# EAGLE schematic MIPS_Rev5.4 (EAGLE 9.6.2)

## Sheet 1 of 2
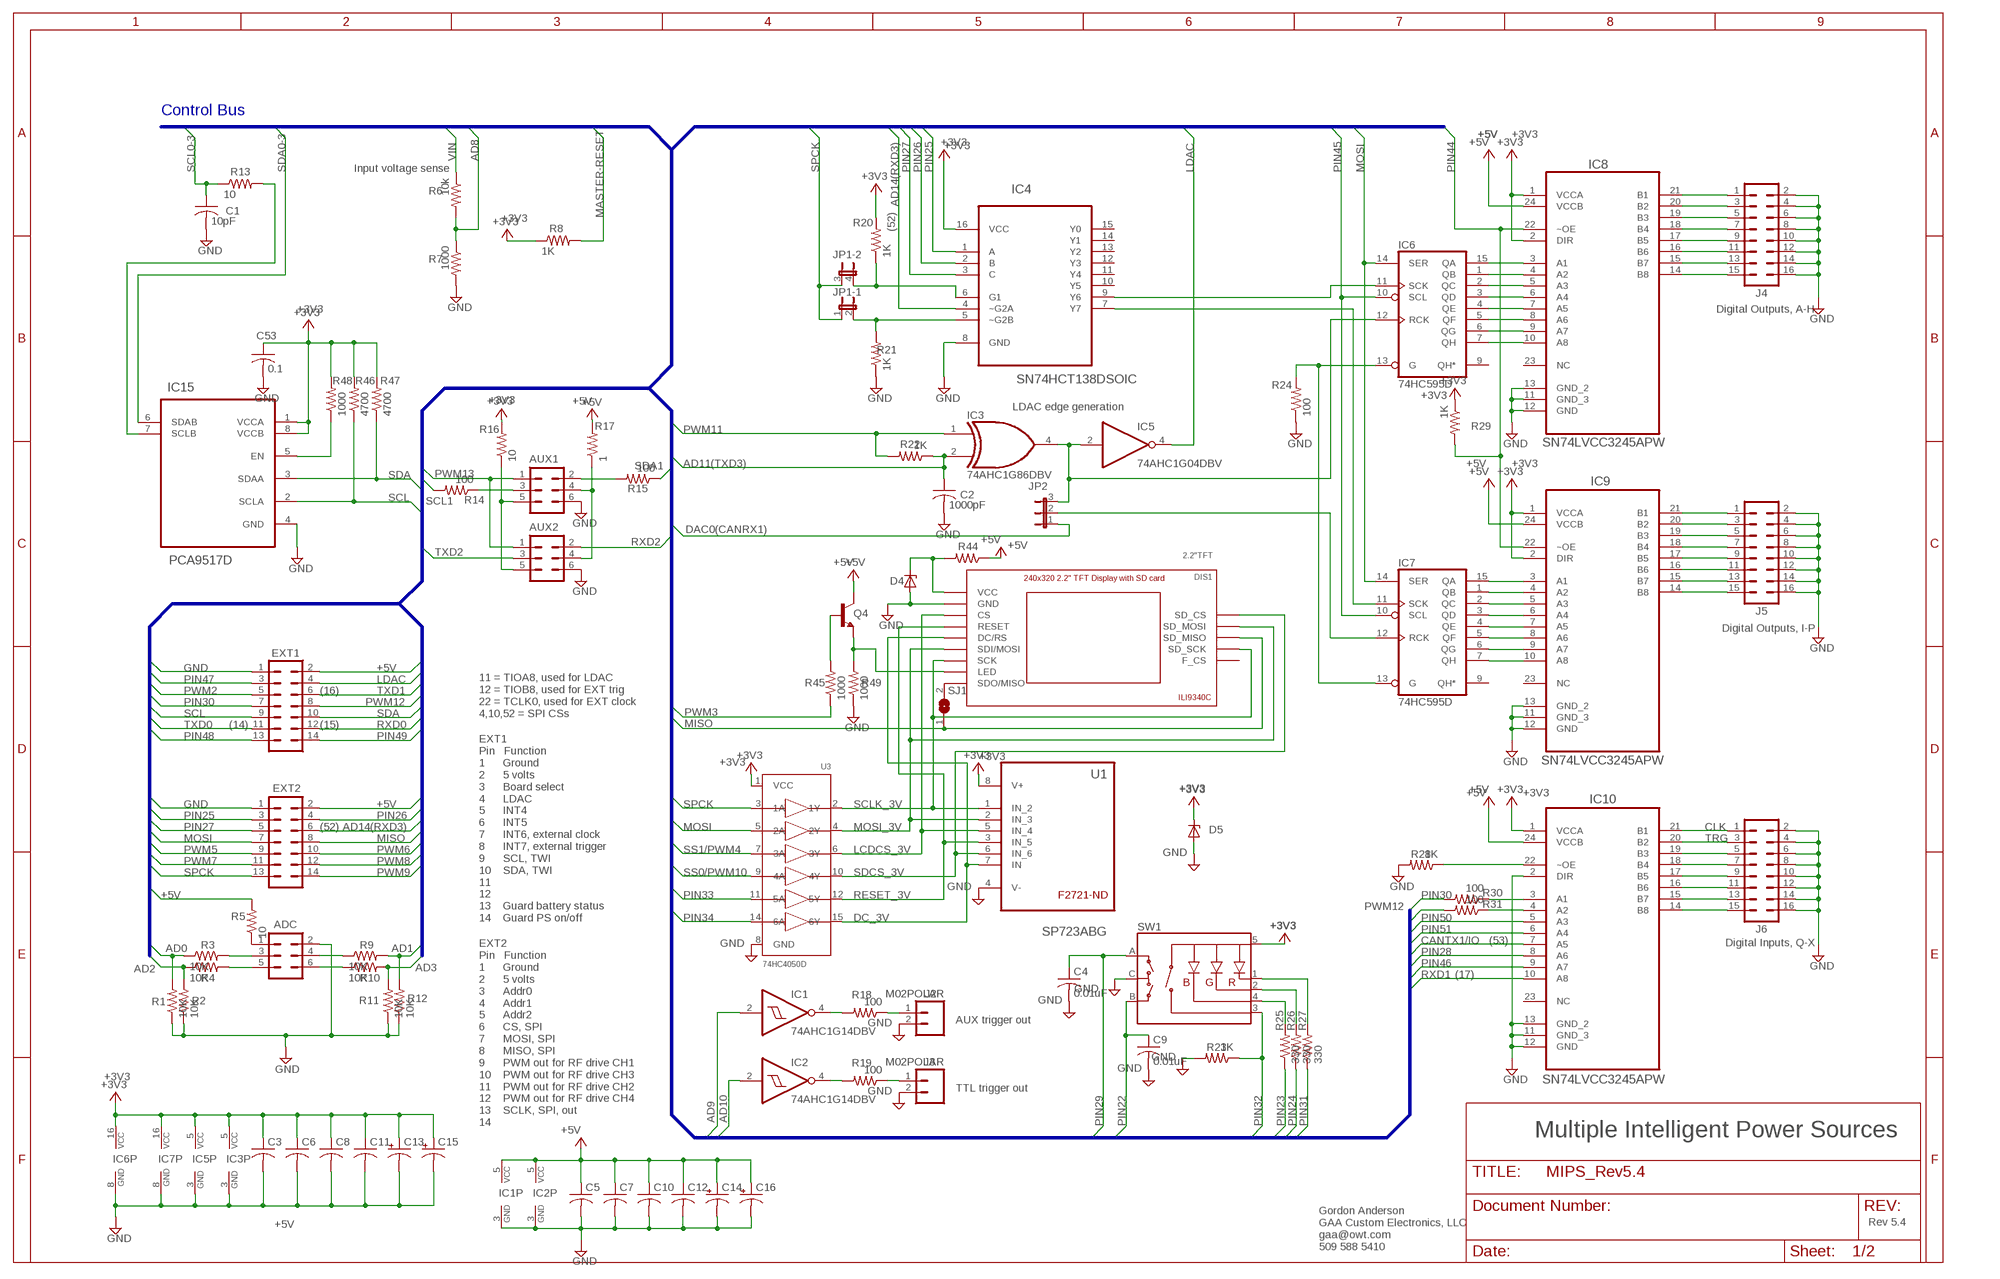
[diagram p0: schematic, sheet 1]

### Parts
ADC  ML6  [ML6]
AUX1  ML6  [ML6]
AUX2  ML6  [ML6]
C1  10pF  C-USC0805  [C0805]
C2  1000pF  C-USC0805  [C0805]
C3  C-USC0805  [C0805]
C4  0.01uF  C-USC0805  [C0805]
C5  C-USC0805  [C0805]
C6  C-USC0805  [C0805]
C7  C-USC0805  [C0805]
C8  C-USC0805  [C0805]
C9  0.01uF  C-USC0805  [C0805]
C10  C-USC0805  [C0805]
C11  C-USC0805  [C0805]
C12  C-USC0805  [C0805]
C13  CPOL-USA/3216-18R  [A/3216-18R]
C14  CPOL-USA/3216-18R  [A/3216-18R]
C15  CPOL-USA/3216-18R  [A/3216-18R]
C16  CPOL-USA/3216-18R  [A/3216-18R]
C53  0.1  C-USC0805  [C0805]
D4  ZENER-DIODESOD123  [SOD123]
D5  ZENER-DIODESOD123  [SOD123]
DIS1  2.2"TFT  [2.2"TFT]
EXT1  ML14  [ML14]
EXT2  ML14  [ML14]
IC1  74AHC1G14DBV  [SOT23-5]
IC2  74AHC1G14DBV  [SOT23-5]
IC3  74AHC1G86DBV  [SOT23-5]
IC4  SN74HCT138DSOIC  [SO16]
IC5  74AHC1G04DBV  [SOT23-5]
IC6  74HC595D  [SO16]
IC7  74HC595D  [SO16]
IC8  SN74LVCC3245APW  [SOP65P640X120-24N]
IC9  SN74LVCC3245APW  [SOP65P640X120-24N]
IC10  SN74LVCC3245APW  [SOP65P640X120-24N]
IC15  PCA9517D  [SOIC127P600X175-8N]
J2  M02POLAR  [MOLEX-1X2]
J3  M02POLAR  [MOLEX-1X2]
J4  ML16  [ML16]
J5  ML16  [ML16]
J6  ML16  [ML16]
JP1  JP2QE  [JP2Q]
JP2  JP2E  [JP2]
Q4  MMBT2222ALT1-NPN-SOT23-BEC  [SOT23-BEC]
R1  10K  R-US_R0805  [R0805]
R2  10K  R-US_R0805  [R0805]
R3  10K  R-US_R0805  [R0805]
R4  10K  R-US_R0805  [R0805]
R5  10  R-US_R1206  [R1206]
R6  10k  R-US_R0805  [R0805]
R7  1000  R-US_R0805  [R0805]
R8  1K  R-US_R0805  [R0805]
R9  10K  R-US_R0805  [R0805]
R10  10K  R-US_R0805  [R0805]
R11  10K  R-US_R0805  [R0805]
R12  10K  R-US_R0805  [R0805]
R13  10  R-US_R0805  [R0805]
R14  100  R-US_R0805  [R0805]
R15  100  R-US_R0805  [R0805]
R16  10  R-US_R0805  [R0805]
R17  1  R-US_R0805  [R0805]
R18  100  R-US_R0805  [R0805]
R19  100  R-US_R0805  [R0805]
R20  1K  R-US_R0805  [R0805]
R21  1K  R-US_R0805  [R0805]
R22  1K  R-US_R0805  [R0805]
R23  1K  R-US_R0805  [R0805]
R24  100  R-US_R0805  [R0805]
R25  330  R-US_R0805  [R0805]
R26  330  R-US_R0805  [R0805]
R27  330  R-US_R0805  [R0805]
R28  1K  R-US_R0805  [R0805]
R29  1K  R-US_R0805  [R0805]
R30  100  R-US_R0805  [R0805]
R31  100  R-US_R0805  [R0805]
R44  R-US_R0805  [R0805]
R45  1000  R-US_R0805  [R0805]
R46  4700  R-US_R0805  [R0805]
R47  4700  R-US_R0805  [R0805]
R48  1000  R-US_R0805  [R0805]
R49  1000  R-US_R0805  [R0805]
SJ1  SJ  [SJ]
SW1  ENCODER_RGB_CA  [ENCODER_LED_3]
U1  SP723ABG  [SOIC127P600X175-8N]
U3  74HC4050D  [SOIC16]

### Nets
+3V3: C3.1 C6.1 C8.1 C11.1 C13.+ C15.+ C53.1 D5.C IC3.5(VCC) IC4.16(VCC) IC5.5(VCC) IC6.16(VCC) IC7.16(VCC) IC8.1(VCCA) IC8.2(DIR) IC9.1(VCCA) IC9.2(DIR) IC10.1(VCCA) IC15.1(VCCA) IC15.8(VCCB) R8.1 R16.2 R20.2 R29.1 R46.2 R47.2 R48.2 SW1.5(+) U1.8(V+) U3.1(VCC) ; also sheet 2
+5V [USB]: C5.1 C7.1 C10.1 C12.1 C14.+ C16.+ EXT1.2 EXT2.2 IC1.5(VCC) IC2.5(VCC) IC8.24(VCCB) IC9.24(VCCB) IC10.24(VCCB) Q4.C R5.2 R17.2 R44.1 ; also sheet 2
AD0: R1.2 R3.1 ; also sheet 2
AD1: R9.2 R12.2 ; also sheet 2
AD2: R2.2 R4.1 ; also sheet 2
AD3: R10.2 R11.2 ; also sheet 2
AD8: R6.2 R7.1 ; also sheet 2
AD9: IC1.2(I) ; also sheet 2
AD10: IC2.2(I) ; also sheet 2
AD11(TXD3): C2.1 IC3.2(I1) R22.1 ; also sheet 2
AD14(RXD3): EXT2.6 IC4.4(~G2A) ; also sheet 2
CANTX1/IO: IC10.7(A5) ; also sheet 2
DAC0(CANRX1): JP2.1 ; also sheet 2
DC_3V: DIS1.DC/RS U1.7(IN) U3.15(6Y)
GND [USB]: ADC.2 AUX1.6 AUX2.6 C1.2 C2.2 C3.2 C4.2 C5.2 C6.2 C7.2 C8.2 C9.2 C10.2 C11.2 C12.2 C13.- C14.- C15.- C16.- C53.2 D4.A D5.A DIS1.GND EXT1.1 EXT2.1 IC1.3(GND) IC2.3(GND) IC3.3(GND) IC4.8(GND) IC5.3(GND) IC6.8(GND) IC7.8(GND) IC8.11(GND_3) IC8.12(GND) IC8.13(GND_2) IC9.11(GND_3) IC9.12(GND) IC9.13(GND_2) IC10.2(DIR) IC10.11(GND_3) IC10.12(GND) IC10.13(GND_2) IC15.4(GND) J2.2 J3.2 J4.2 J4.4 J4.6 J4.8 J4.10 J4.12 J4.14 J4.16 J5.2 J5.4 J5.6 J5.8 J5.10 J5.12 J5.14 J5.16 J6.2 J6.4 J6.6 J6.8 J6.10 J6.12 J6.14 J6.16 R1.1 R2.1 R7.2 R11.1 R12.1 R21.1 R23.2 R24.1 R28.2 R49.1 SW1.C U1.4(V-) U3.8(GND) ; also sheet 2
LCDCS_3V: DIS1.CS U1.5(IN_4) U3.6(3Y)
LDAC: EXT1.4 IC5.4(O)
MASTER-RESET: R8.2 ; also sheet 2
MISO: DIS1.SD_MISO EXT2.8 SJ1.1 ; also sheet 2
MOSI: EXT2.7 IC6.14(SER) IC7.14(SER) U3.5(2A) ; also sheet 2
MOSI_3V: DIS1.SD_MOSI DIS1.SDI/MOSI U1.2(IN_3) U3.4(2Y)
N$1: IC6.15(QA) IC8.3(A1)
N$2: IC6.1(QB) IC8.4(A2)
N$3: IC6.2(QC) IC8.5(A3)
N$4: IC6.3(QD) IC8.6(A4)
N$5: IC6.4(QE) IC8.7(A5)
N$6: IC6.5(QF) IC8.8(A6)
N$7: IC6.6(QG) IC8.9(A7)
N$8: IC6.7(QH) IC8.10(A8)
N$9: IC7.1(QB) IC9.4(A2)
N$10: IC7.2(QC) IC9.5(A3)
N$11: IC7.3(QD) IC9.6(A4)
N$12: IC7.4(QE) IC9.7(A5)
N$13: IC7.5(QF) IC9.8(A6)
N$14: IC7.6(QG) IC9.9(A7)
N$15: IC7.7(QH) IC9.10(A8)
N$16: IC7.15(QA) IC9.3(A1)
N$17: IC9.21(B1) J5.1
N$18: IC9.20(B2) J5.3
N$19: IC9.19(B3) J5.5
N$20: IC9.18(B4) J5.7
N$21: IC9.17(B5) J5.9
N$22: IC9.16(B6) J5.11
N$23: IC9.15(B7) J5.13
N$24: IC9.14(B8) J5.15
N$25: IC8.21(B1) J4.1
N$26: IC8.20(B2) J4.3
N$27: IC8.19(B3) J4.5
N$28: IC8.18(B4) J4.7
N$29: IC8.17(B5) J4.9
N$30: IC8.16(B6) J4.11
N$31: IC8.15(B7) J4.13
N$32: IC8.14(B8) J4.15
N$33: IC10.21(B1) J6.1
N$34: IC10.20(B2) J6.3
N$35: IC10.19(B3) J6.5
N$36: IC10.18(B4) J6.7
N$37: IC10.17(B5) J6.9
N$38: IC10.16(B6) J6.11
N$39: IC10.15(B7) J6.13
N$40: IC10.14(B8) J6.15
N$41: IC4.7(Y7) IC7.11(SCK)
N$42: ADC.3 R3.2
N$43: ADC.1 R5.1
N$44: ADC.4 R9.1
N$45: ADC.5 R4.2
N$46: IC10.22(~OE) R28.1
N$47: ADC.6 R10.1
N$48: IC7.12(RCK) JP2.2
N$49: IC15.5(EN) R48.1
N$50: IC10.3(A1) R30.1
N$51: IC10.4(A2) R31.1
N$52: D4.C DIS1.P$9VCC(VCC) R44.2
N$53: IC15.7(SCLB) R13.2
N$54: DIS1.SDO/MISO SJ1.2
N$55: IC2.4(O) R19.2
N$56: IC1.4(O) R18.2
N$57: J3.1 R19.1
N$58: IC6.13(G) IC7.13(G) R24.2
N$59: J2.1 R18.1
N$60: AUX1.2 R15.2
N$61: AUX1.3 R14.1
N$62: AUX1.4 AUX2.4 R17.1
N$64: AUX1.5 AUX2.5 R16.1
N$78: DIS1.LED Q4.E R49.2
N$80: Q4.B R45.2
N$93: IC4.9(Y6) IC6.11(SCK)
N$97: IC4.5(~G2B) JP1.2 R21.2
N$98: IC4.6(G1) JP1.4 R20.1
N$101: R27.2 SW1.1(-R)
N$102: R26.2 SW1.2(-G)
N$103: R25.2 SW1.4(-B)
PIN22: C9.1 SW1.B ; also sheet 2
PIN23: R25.1 ; also sheet 2
PIN24: R26.1 ; also sheet 2
PIN25: EXT2.3 IC4.1(A) ; also sheet 2
PIN26: EXT2.4 IC4.2(B) ; also sheet 2
PIN27: EXT2.5 IC4.3(C) ; also sheet 2
PIN28: IC10.8(A6) ; also sheet 2
PIN29: C4.1 SW1.A ; also sheet 2
PIN30: EXT1.7 R30.2 ; also sheet 2
PIN31: R27.1 ; also sheet 2
PIN32: R23.1 SW1.3(SW) ; also sheet 2
PIN33: U3.11(5A) ; also sheet 2
PIN34: U3.14(6A) ; also sheet 2
PIN44: IC8.22(~OE) IC9.22(~OE) R29.2 ; also sheet 2
PIN45: IC6.10(SCL) IC7.10(SCL) ; also sheet 2
PIN46: IC10.9(A7) ; also sheet 2
PIN47: EXT1.3 ; also sheet 2
PIN48: EXT1.13 ; also sheet 2
PIN49: EXT1.14 ; also sheet 2
PIN50: IC10.5(A3) ; also sheet 2
PIN51: IC10.6(A4) ; also sheet 2
PWM2: EXT1.5 ; also sheet 2
PWM3: R45.1 ; also sheet 2
PWM5: EXT2.9 ; also sheet 2
PWM6: EXT2.10 ; also sheet 2
PWM7: EXT2.11 ; also sheet 2
PWM8: EXT2.12 ; also sheet 2
PWM9: EXT2.14 ; also sheet 2
PWM11: IC3.1(I0) R22.2 ; also sheet 2
PWM12: EXT1.8 R31.2 ; also sheet 2
PWM13: AUX1.1 AUX2.1 ; also sheet 2
RESET_3V: DIS1.RESET U1.3(IN_5) U3.12(5Y)
RXD0: EXT1.12 ; also sheet 2
RXD1: IC10.10(A8) ; also sheet 2
RXD2: AUX2.2 ; also sheet 2
SCL: EXT1.9 IC15.2(SCLA) R46.1
SCL0-3: C1.1 R13.1 ; also sheet 2
SCL1: R14.2 ; also sheet 2
SCLK_3V: DIS1.SCK DIS1.SD_SCK U1.1(IN_2) U3.2(1Y)
SDA: EXT1.10 IC15.3(SDAA) R47.1
SDA0-3: IC15.6(SDAB) ; also sheet 2
SDA1: R15.1 ; also sheet 2
SDCS_3V: DIS1.SD_CS U1.6(IN_6) U3.10(4Y)
SPCK: EXT2.13 JP1.1 JP1.3 U3.3(1A) ; also sheet 2
SS0/PWM10: U3.9(4A) ; also sheet 2
SS1/PWM4: U3.7(3A) ; also sheet 2
TXD0: EXT1.11 ; also sheet 2
TXD1: EXT1.6 ; also sheet 2
TXD2: AUX2.3 ; also sheet 2
VIN: R6.1 ; also sheet 2
~LDAC: IC3.4(O) IC5.2(I) IC6.12(RCK) JP2.3
Unconnected: DIS1.F_CS IC4.10(Y5) IC4.11(Y4) IC4.12(Y3) IC4.13(Y2) IC4.14(Y1) IC4.15(Y0) IC6.9(QH*) IC7.9(QH*) IC8.23(NC) IC9.23(NC) IC10.23(NC)

### Buses
+5V,DAC0(CANRX1),MISO,N$73,N$74,N$75,N$79,N$81,PWM3,SCL1,SDA1

### Notes on the sheet
- Control Bus
- Input voltage sense
- (52)
- Digital Outputs, A-H
- LDAC edge generation
- Digital Outputs, I-P
- (16)
- 11 = TIOA8, used for LDAC
  12 = TIOB8, used for EXT trig
  22 = TCLK0, used for EXT clock
  4,10,52 = SPI CSs
- (14) | (15)
- (52) | CLK
- TRG
- F2721-ND
- EXT1
  Pin   Function
  1      Ground
  2      5 volts
  3      Board select
  4      LDAC
  5      INT4
  6      INT5
  7      INT6, external clock
  8      INT7, external trigger
  9      SCL, TWI
  10    SDA, TWI
  11
  12
  13    Guard battery status
  14    Guard PS on/off
- (53) | Digital Inputs, Q-X
- (17)
- AUX trigger out
- TTL trigger out
- EXT2
  Pin   Function
  1      Ground
  2      5 volts
  3      Addr0
  4      Addr1
  5      Addr2
  6      CS, SPI
  7      MOSI, SPI
  8      MISO, SPI
  9      PWM out for RF drive CH1
  10    PWM out for RF drive CH3
  11    PWM out for RF drive CH2
  12    PWM out for RF drive CH4
  13    SCLK, SPI, out
  14
- Multiple Intelligent Power Sources
- Rev 5.4
- Gordon Anderson
  GAA Custom Electronics, LLC
  gaa@owt.com
  509 588 5410

## Sheet 2 of 2
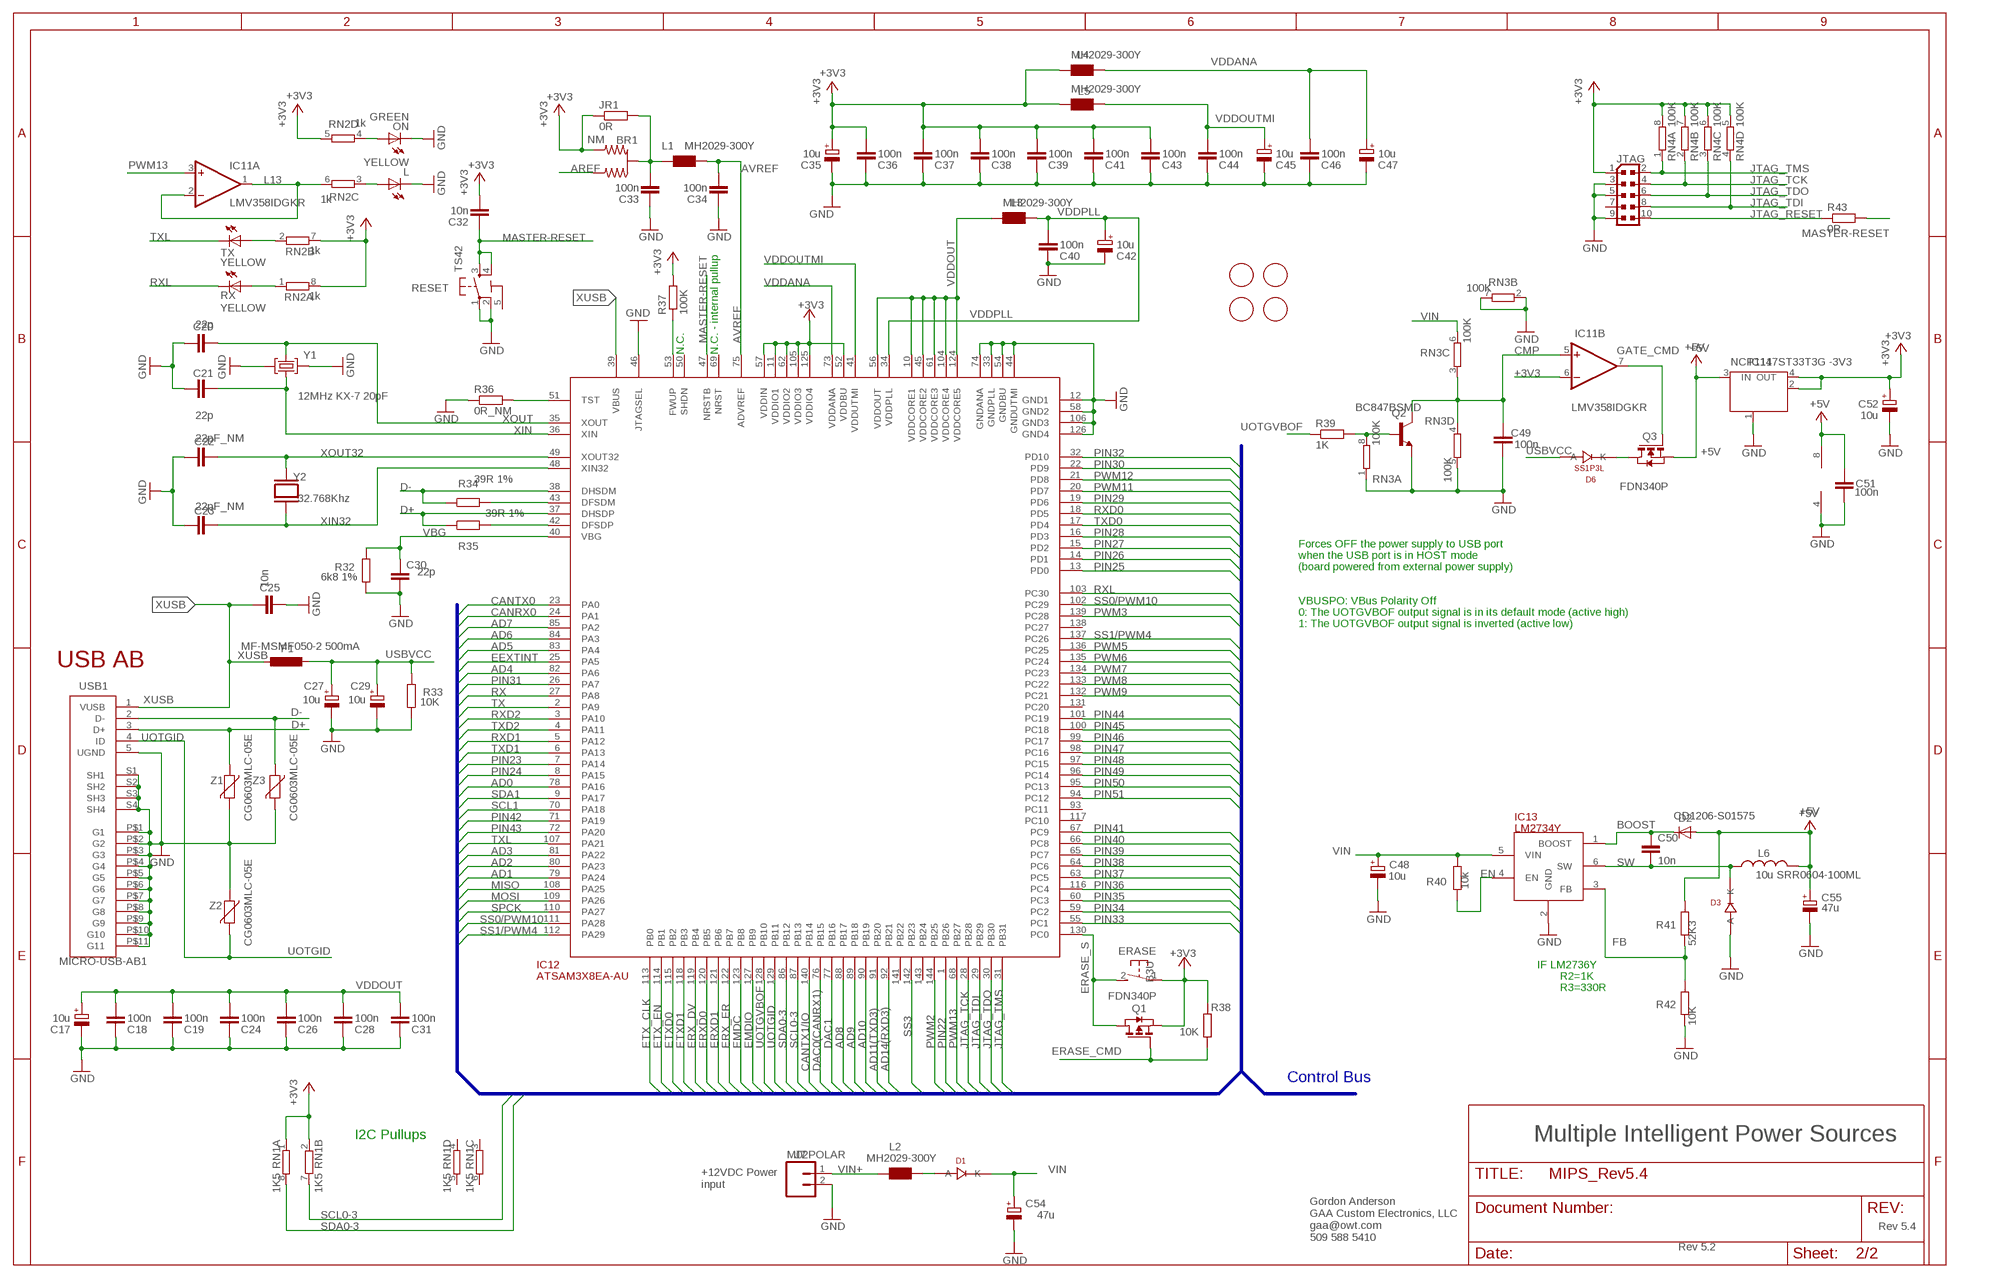
[diagram p1: schematic, sheet 2]

### Parts
BR1  NM  J0402  [J0402]
C17  10u  CPOL-EUSMCB  [SMC_B]
C18  100n  C-EUC0402  [C0402]
C19  100n  C-EUC0402  [C0402]
C20  22p  C-EUC0402  [C0402]
C21  22p  C-EUC0402  [C0402]
C22  22pF_NM  C-EUC0402  [C0402]
C23  22pF_NM  C-EUC0402  [C0402]
C24  100n  C-EUC0402  [C0402]
C25  10n  C-EUC0402  [C0402]
C26  100n  C-EUC0402  [C0402]
C27  10u  CPOL-EUSMCB  [SMC_B]
C28  100n  C-EUC0402  [C0402]
C29  10u  CPOL-EUSMCB  [SMC_B]
C30  22p  C-EUC0402  [C0402]
C31  100n  C-EUC0402  [C0402]
C32  10n  C-EUC0402  [C0402]
C33  100n  C-EUC0402  [C0402]
C34  100n  C-EUC0402  [C0402]
C35  10u  CPOL-EUSMCB  [SMC_B]
C36  100n  C-EUC0402  [C0402]
C37  100n  C-EUC0402  [C0402]
C38  100n  C-EUC0402  [C0402]
C39  100n  C-EUC0402  [C0402]
C40  100n  C-EUC0402  [C0402]
C41  100n  C-EUC0402  [C0402]
C42  10u  CPOL-EUSMCB  [SMC_B]
C43  100n  C-EUC0402  [C0402]
C44  100n  C-EUC0402  [C0402]
C45  10u  CPOL-EUSMCB  [SMC_B]
C46  100n  C-EUC0402  [C0402]
C47  10u  CPOL-EUSMCB  [SMC_B]
C48  10u  CPOL-EUSMCB  [SMC_B]
C49  100n  C-EUC0402  [C0402]
C50  10n  C-EUC0603  [C0603-ROUND]
C51  100n  C-EUC0402  [C0402]
C52  10u  CPOL-EUSMCB  [SMC_B]
C54  47u  CPOL-EUD  [PANASONIC_D]
C55  47u  CPOL-EUD  [PANASONIC_D]
D1  SS1P3L  [DO220AAL]
D2  CD1206-S01575  DIODE-MINIMELF  [MINIMELF]
D3  SS1P3L  [DO220AAL]
D6  SS1P3L  [DO220AAL]
ERASE  B3U  [B3U]
F1  MF-MSMF050-2 500mA  L-EUL1812  [L1812]
FID1  FIDUCIALMOUNT  [FIDUCIA-MOUNT]
FID2  FIDUCIALMOUNT  [FIDUCIA-MOUNT]
FID3  FIDUCIALMOUNT  [FIDUCIA-MOUNT]
FID4  FIDUCIALMOUNT  [FIDUCIA-MOUNT]
IC11  LMV358IDGKR  LMV358MMX  [MSOP08]
IC12  ATSAM3X8EA-AU  ATSAM3X/AAU  [LQFP144]
IC13  LM2734Y  LM2736Y  [SOT23-6]
IC14  NCP1117ST33T3G -3V3  MC33269ST-3.3T3  [SOT223]
J7  M02POLAR  [MOLEX-1X2]
JR1  0R  R-EU_R0402  [R0402]
JTAG  PINHEAD_PINHD-2X5PASSO127  [PINHEAD_2X05_127]
L  YELLOW  LEDCHIP-LED0805  [CHIP-LED0805]
L1  MH2029-300Y  WE-CBF_0805  [0805]
L2  MH2029-300Y  WE-CBF_0805  [0805]
L3  MH2029-300Y  WE-CBF_0805  [0805]
L4  MH2029-300Y  WE-CBF_0805  [0805]
L5  MH2029-300Y  WE-CBF_0805  [0805]
L6  10u SRR0604-100ML  L-USSRR0604  [SRR0604]
ON  GREEN  LEDCHIP-LED0805  [CHIP-LED0805]
Q1  FDN340P  PMOSSOT23  [SOT-23]
Q2  BC847BSMD  [SOT23]
Q3  FDN340P  NMOSSOT23  [SOT-23]
R32  6k8 1%  R-EU_R0603  [R0603-ROUND]
R33  10K  R-EU_R0402  [R0402]
R34  39R 1%  R-EU_R0402  [R0402]
R35  39R 1%  R-EU_R0402  [R0402]
R36  0R_NM  R-EU_R0402  [R0402]
R37  100K  R-EU_R0402  [R0402]
R38  10K  R-EU_R0402  [R0402]
R39  1K  R-EU_R0402  [R0402]
R40  10k  R-EU_R0402  [R0402]
R41  52K3  R-EU_0603-RND  [R0603-ROUND]
R42  10K  R-EU_0603-RND  [R0603-ROUND]
R43  0R  R-EU_R0402  [R0402]
RESET  TS42  [TS42]
RN1  1K5  4R-NCAT16  [CAT16]
RN2  1k  4R-NCAY16  [CAY16]
RN3  100K  4R-NCAT16  [CAT16]
RN4  100K  4R-NCAT16  [CAT16]
RX  YELLOW  LEDCHIP-LED0805  [CHIP-LED0805]
TX  YELLOW  LEDCHIP-LED0805  [CHIP-LED0805]
USB1  MICRO-USB-AB1  MICRO_USB  [MCR-AB1-S-RA-SMT]
Y1  12MHz KX-7 20pF  CRYSTAL-3.2-2.5  [CRYSTAL-3.2-2.5]
Y2  32.768Khz  CM8V-T1A-32.768KHZ-9PF-20PPM-TA-QC  [XTAL_CM8V-T1A-32.768KHZ-9PF-20PPM-TA-QC]
Z1  CG0603MLC-05E  VARISTORCN0603  [CT/CN0603]
Z2  CG0603MLC-05E  VARISTORCN0603  [CT/CN0603]
Z3  CG0603MLC-05E  VARISTORCN0603  [CT/CN0603]

### Nets
+3V3: BR1.3 C32.2 C35.+ C36.2 C37.2 C38.2 C39.2 C41.2 C43.2 C52.+ ERASE.1 IC11.6(B:-IN) IC12.11(VDDIO1) IC12.52(VDDBU) IC12.57(VDDIN) IC12.62(VDDIO2) IC12.105(VDDIO3) IC12.125(VDDIO4) IC14.2(OUT) IC14.4(OUT) JR1.1 JTAG.1 L4.1 L5.1 Q1.2(S) R37.2 R38.2 RN1.1 RN1.2 RN2.5 RN2.7 RN2.8 RN4.5 RN4.6 RN4.7 RN4.8 ; also sheet 1
+5V [USB]: C51.2 C55.+ D2.A IC11.8(P:V+) IC14.3(IN) L6.P$2 Q3.2(S) R41.1 ; also sheet 1
AD0: IC12.78(PA16) ; also sheet 1
AD1: IC12.79(PA24) ; also sheet 1
AD2: IC12.80(PA23) ; also sheet 1
AD3: IC12.81(PA22) ; also sheet 1
AD4: IC12.82(PA6)
AD5: IC12.83(PA4)
AD6: IC12.84(PA3)
AD7: IC12.85(PA2)
AD8: IC12.88(PB17) ; also sheet 1
AD9: IC12.89(PB18) ; also sheet 1
AD10: IC12.90(PB19) ; also sheet 1
AD11(TXD3): IC12.91(PB20) ; also sheet 1
AD14(RXD3): IC12.92(PB21) ; also sheet 1
AREF: BR1.1
AVREF: C34.2 IC12.75(ADVREF) L1.2
AVREFL: BR1.2(C) C33.2 JR1.2 L1.1
BOOST: C50.1 D2.C IC13.1(BOOST)
CANRX0: IC12.24(PA1)
CANTX0: IC12.23(PA0)
CANTX1/IO: IC12.140(PB14) ; also sheet 1
CMP: C49.2 IC11.5(B:+IN) Q2.3(C) RN3.3 RN3.4
D+ [USBpair]: IC12.37(DHSDP) R35.1 USB1.3(D+) Z1.1
D- [USBpair]: IC12.38(DHSDM) R34.1 USB1.2(D-) Z3.1
DAC0(CANRX1): IC12.76(PB15) ; also sheet 1
DAC1: IC12.77(PB16)
EEXTINT: IC12.25(PA5)
EMDC: IC12.123(PB8)
EMDIO: IC12.127(PB9)
EN: IC13.4(EN) R40.2
ERASE_CMD: Q1.3(G) R38.1
ERASE_S: ERASE.2 IC12.130(PC0) Q1.1(D)
ERX_DV: IC12.119(PB4)
ERX_ER: IC12.122(PB7)
ERXD0: IC12.120(PB5)
ERXD1: IC12.121(PB6)
ETX_CLK: IC12.113(PB0)
ETX_EN: IC12.114(PB1)
ETXD0: IC12.115(PB2)
ETXD1: IC12.118(PB3)
FB: IC13.3(FB) R41.2 R42.1
GATE_CMD: IC11.7(B:OUT) Q3.3(G)
GND [USB]: C17.- C18.1 C19.1 C20.2 C21.2 C22.2 C23.2 C24.1 C25.2 C26.1 C27.- C28.1 C29.- C30.2 C31.1 C33.1 C34.1 C35.- C36.1 C37.1 C38.1 C39.1 C40.1 C41.1 C42.- C43.1 C44.1 C45.- C46.1 C47.- C48.- C49.1 C51.1 C52.- C54.- C55.- D3.P$2(A) IC11.4(P:V-) IC12.12(GND1) IC12.33(GNDPLL) IC12.44(GNDUTMI) IC12.46(JTAGSEL) IC12.54(GNDBU) IC12.58(GND2) IC12.74(GNDANA) IC12.106(GND3) IC12.126(GND4) IC13.2(GND) IC14.1(GND/ADJ) J7.2 JTAG.3 JTAG.5 JTAG.9 L.C ON.C Q2.2(E) R32.1 R33.1 R36.1 R42.2 RESET.1 RESET.2 RN3.1 RN3.2 RN3.5 RN3.7 USB1.5(UGND) USB1.P$1(G1) USB1.P$2(G2) USB1.P$3(G3) USB1.P$4(G4) USB1.P$5(G5) USB1.P$6(G6) USB1.P$7(G7) USB1.P$8(G8) USB1.P$9(G9) USB1.P$10(G10) USB1.P$11(G11) USB1.S1(SH1) USB1.S2(SH2) USB1.S3(SH3) USB1.S4(SH4) Y1.2(GND) Y1.4(GND) Z1.2 Z2.1 Z3.2 ; also sheet 1
JTAG_RESET: JTAG.10 R43.1
JTAG_TCK: IC12.28(PB28) JTAG.4 RN4.2
JTAG_TDI: IC12.29(PB29) JTAG.8 RN4.4
JTAG_TDO: IC12.30(PB30) JTAG.6 RN4.3
JTAG_TMS: IC12.31(PB31) JTAG.2 RN4.1
L13: IC11.1(A:OUT) IC11.2(A:-IN) RN2.6
MASTER-RESET: C32.1 IC12.47(NRSTB) R43.2 RESET.3 RESET.4 ; also sheet 1
MISO: IC12.108(PA25) ; also sheet 1
MOSI: IC12.109(PA26) ; also sheet 1
N$63: ON.A RN2.4
N$65: RN2.1 RX.A
N$66: RN2.2 TX.A
N$67: L.A RN2.3
N$68: IC12.43(DFSDM) R34.2
N$69: IC12.42(DFSDP) R35.2
N$70: IC12.51(TST) R36.2
N$71: Q2.1(B) R39.2 RN3.8
N$72: IC12.53(FWUP) R37.1
N$73: D6.P$1(K) Q3.1(D)
N$77: D1.P$2(A) L2.1
PIN22: IC12.1(PB26) ; also sheet 1
PIN23: IC12.7(PA14) ; also sheet 1
PIN24: IC12.8(PA15) ; also sheet 1
PIN25: IC12.13(PD0) ; also sheet 1
PIN26: IC12.14(PD1) ; also sheet 1
PIN27: IC12.15(PD2) ; also sheet 1
PIN28: IC12.16(PD3) ; also sheet 1
PIN29: IC12.19(PD6) ; also sheet 1
PIN30: IC12.22(PD9) ; also sheet 1
PIN31: IC12.26(PA7) ; also sheet 1
PIN32: IC12.32(PD10) ; also sheet 1
PIN33: IC12.55(PC1) ; also sheet 1
PIN34: IC12.59(PC2) ; also sheet 1
PIN35: IC12.60(PC3)
PIN36: IC12.116(PC4)
PIN37: IC12.63(PC5)
PIN38: IC12.64(PC6)
PIN39: IC12.65(PC7)
PIN40: IC12.66(PC8)
PIN41: IC12.67(PC9)
PIN42: IC12.71(PA19)
PIN43: IC12.72(PA20)
PIN44: IC12.101(PC19) ; also sheet 1
PIN45: IC12.100(PC18) ; also sheet 1
PIN46: IC12.99(PC17) ; also sheet 1
PIN47: IC12.98(PC16) ; also sheet 1
PIN48: IC12.97(PC15) ; also sheet 1
PIN49: IC12.96(PC14) ; also sheet 1
PIN50: IC12.95(PC13) ; also sheet 1
PIN51: IC12.94(PC12) ; also sheet 1
PWM2: IC12.144(PB25) ; also sheet 1
PWM3: IC12.139(PC28) ; also sheet 1
PWM5: IC12.136(PC25) ; also sheet 1
PWM6: IC12.135(PC24) ; also sheet 1
PWM7: IC12.134(PC23) ; also sheet 1
PWM8: IC12.133(PC22) ; also sheet 1
PWM9: IC12.132(PC21) ; also sheet 1
PWM11: IC12.20(PD7) ; also sheet 1
PWM12: IC12.21(PD8) ; also sheet 1
PWM13: IC11.3(A:+IN) IC12.68(PB27) ; also sheet 1
RX: IC12.27(PA8)
RXD0: IC12.18(PD5) ; also sheet 1
RXD1: IC12.5(PA12) ; also sheet 1
RXD2: IC12.3(PA10) ; also sheet 1
RXL: IC12.103(PC30) RX.C
SCL0-3: IC12.87(PB13) RN1.7 ; also sheet 1
SCL1: IC12.70(PA18) ; also sheet 1
SDA0-3: IC12.86(PB12) RN1.8 ; also sheet 1
SDA1: IC12.9(PA17) ; also sheet 1
SPCK: IC12.110(PA27) ; also sheet 1
SS0/PWM10: IC12.102(PC29) IC12.111(PA28) ; also sheet 1
SS1/PWM4: IC12.112(PA29) IC12.137(PC26) ; also sheet 1
SS3: IC12.142(PB23)
SW: C50.2 D3.P$1(K) IC13.6(SW) L6.P$1
TX: IC12.2(PA9)
TXD0: IC12.17(PD4) ; also sheet 1
TXD1: IC12.6(PA13) ; also sheet 1
TXD2: IC12.4(PA11) ; also sheet 1
TXL: IC12.107(PA21) TX.C
UOTGID: IC12.129(PB11) USB1.4(ID) Z2.2
UOTGVBOF: IC12.128(PB10) R39.1
USBVCC: C27.+ C29.+ D6.P$2(A) F1.1 R33.2
VBG: C30.1 IC12.40(VBG) R32.2
VDDANA: C46.2 C47.+ IC12.73(VDDANA) L4.2
VDDOUT: C17.+ C18.2 C19.2 C24.2 C26.2 C28.2 C31.2 IC12.10(VDDCORE1) IC12.45(VDDCORE2) IC12.56(VDDOUT) IC12.61(VDDCORE3) IC12.104(VDDCORE4) IC12.124(VDDCORE5) L3.1
VDDOUTMI: C44.2 C45.+ IC12.41(VDDUTMI) L5.2
VDDPLL: C40.2 C42.+ IC12.34(VDDPLL) L3.2
VIN: C48.+ C54.+ D1.P$1(K) IC13.5(VIN) R40.1 RN3.6 ; also sheet 1
VIN+: J7.1 L2.2
XIN: C21.1 IC12.36(XIN) Y1.1(C1)
XIN32: C23.1 IC12.48(XIN32) Y2.2
XOUT: C20.1 IC12.35(XOUT) Y1.3(C2)
XOUT32: C22.1 IC12.49(XOUT32) Y2.1
XUSB [usbvcc]: C25.1 F1.2 IC12.39(VBUS) USB1.1(VUSB)
Unconnected: IC12.50(SHDN) IC12.69(NRST) IC12.93(PC11) IC12.117(PC10) IC12.131(PC20) IC12.138(PC27) IC12.141(PB22) IC12.143(PB24) JTAG.7 RN1.3 RN1.4 RN1.5 RN1.6

### Buses
PWM13,UOTGID,UOTGVBOF

### Notes on the sheet
- N.C. | N.C. - internal pullup
- Forces OFF the power supply to USB port
- when the USB port is in HOST mode
- (board powered from external power supply)
- VBUSPO: VBus Polarity Off
- 0: The UOTGVBOF output signal is in its default mode (active high)
- 1: The UOTGVBOF output signal is inverted (active low)
- USB AB
- IF LM2736Y
- R2=1K
- R3=330R
- Control Bus
- I2C Pullups | Multiple Intelligent Power Sources
- +12VDC Power
  input
- Rev 5.4
- Rev 5.2
- Gordon Anderson
  GAA Custom Electronics, LLC
  gaa@owt.com
  509 588 5410

## Power pins joined to a net without a drawn wire
5-GND: RESET.5(5-GND)

## Library data of the parts
ADC AUX1 AUX2 = con-harting-ml:ML6: HARTING; OC_FARNELL: unknown; OC_NEWARK: unknown
BR1 = bibaja:J: Three terminal jumper made from two 0402, 0603, 0805, etc.
C1-C12 C53 = rcl:C-US: CAPACITOR, American symbol
C13-C16 = rcl:CPOL-US: POLARIZED CAPACITOR, American symbol
C17 C27 C29 C35 C42 C45 C47 C48 C52 C54 C55 = rcl:CPOL-EU: POLARIZED CAPACITOR, European symbol
C18-C26 C28 C30-C34 C36-C41 C43 C44 C46 C49-C51 = SmartPrj:C-EU: CAPACITOR, European symbol
D1 D3 D6 = SmartPrj:SS1P3L
D2 = diode:DIODE-: DIODE
D4 D5 = BaySpec:ZENER-DIODE: Z-Diode
DIS1 = GAAextensions:2.2"TFT
ERASE = GAAextensions:B3U: SW1143CT-ND
EXT1 EXT2 = con-harting-ml:ML14: HARTING; OC_FARNELL: unknown; OC_NEWARK: unknown
F1 = rcl:L-EU: INDUCTOR, European symbol
FID1-FID4 = SmartPrj:FIDUCIALMOUNT
IC1 IC2 = 74xx-little-us:74*1G14: Single Schmitt-Trigger Inverter Gate
IC3 = 74xx-little-us:74*1G86: 2-input EXCLUSIV-OR gate
IC4 = Texas Instruments_By_element14_Batch_1:SN74HCT138D: 3-LINE TO 8-LINE DECODERS /DEMULTIPLEXERXS
IC5 = 74xx-little-us:74*1G04: INVERTER Gate
IC6 IC7 = 74xx-eu:74*595: 8-bit SHIFT REGISTER, output latch
IC8-IC10 = Texas Instruments_By_element14_Batch_1:SN74LVCC3245APW: OCTAL BUS TRANSCEIVER WITH ADJUSTABLE OUTPUT VOLTAGE AND 3-STATE OUTPUTS; MPN: SN74LVCC3245APW; OC_FARNELL: 1287636; OC_NEWARK: 02H5425; PACKAGE: TSSOP-24; SUPPLIER: Texas Instruments
IC11 = linear:LMV358?*: Dual General Purpose, Low Voltage, Rail-to-Rail Output Operational Amplifiers Source: http://www.national.com/mpf/LM/LMV321.html http://www.national.com/dt/lmv_qual.pdf
IC12 = SmartPrj:ATSAM3X/A
IC13 = SmartPrj:LM2736Y
IC14 = linear:MC33269ST*: Adjustable Output Low Dropout Voltage Regulator 800 mA Source: http://www.onsemi.com/pub/Collateral/MC33269-D.PDF
IC15 = Texas Instruments_By_element14_Batch_1:PCA9517D: LEVEL-TRANSLATING I2C BUS REPEATER; MPN: PCA9517D; OC_FARNELL: 1831204; OC_NEWARK: 71M0457; PACKAGE: SOIC-8; SUPPLIER: Texas Instruments
J2 J3 J7 = SparkFun-Connectors:M02: Standard 2-pin 0.1" header. Use with - straight break away headers ( PRT-00116) - right angle break away headers (PRT-00553) - swiss pins (PRT-00743) - machine pins (PRT-00117) - female headers (PRT-00115) Molex polarized connector foot print use with: PRT-08233 with associated crimp pins and housings. 2.54_SCREWTERM for use with PRT-10571. 3.5mm Screw Terminal footprints for PRT-08084 5mm Screw Terminal footprints for use with PRT-08433
J4-J6 = con-harting-ml:ML16: HARTING; OC_FARNELL: unknown; OC_NEWARK: unknown
JP1 = jumper:JP2QE: JUMPER
JP2 = jumper:JP2E: JUMPER
JR1 R32-R43 = SmartPrj:R-EU_: RESISTOR, European symbol
JTAG = Arduino_Wifi_shield_v018_tG:PINHEAD_PINHD-2X5: PIN HEADER
L ON RX TX = led:LED: LED OSRAM: - CHIPLED LG R971, LG N971, LY N971, LG Q971, LY Q971, LO R971, LY R971 LH N974, LH R974 LS Q976, LO Q976, LY Q976 LO Q996 - Hyper CHIPLED LW Q18S LB Q993, LB Q99A, LB R99A - SideLED LS A670, LO A670, LY A670, LG A670, LP A670 LB A673, LV A673, LT A673, LW A673 LH A674 LY A675 LS A676, LA A676, LO A676, LY A676, LW A676 LS A679, LY A679, LG A679 - Hyper Micro SIDELED® LS Y876, LA Y876, LO Y876, LY Y876 LT Y87S - SmartLED LW L88C, LW L88S LB L89C, LB L89S, LG L890 LS L89K, LO L89K, LY L89K LS L896, LA L896, LO L896, LY L896 - TOPLED LS T670, LO T670, LY T670, LG T670, LP T670 LSG T670, LSP T670, LSY T670, LOP T670, LYG T670 LG T671, LOG T671, LSG T671 LB T673, LV T673, LT T673, LW T673 LH T674 LS T676, LA T676, LO T676, LY T676, LB T676, LH T676, LSB T676, LW T676 LB T67C, LV T67C, LT T67C, LS T67K, LO T67K, LY T67K, LW E67C LS E67B, LA E67B, LO E67B, LY E67B, LB E67C, LV E67C, LT E67C LW T67C LS T679, LY T679, LG T679 LS T770, LO T770, LY T770, LG T770, LP T770 LB T773, LV T773, LT T773, LW T773 LH T774 LS E675, LA E675, LY E675, LS T675 LS T776, LA T776, LO T776, LY T776, LB T776 LHGB T686 LT T68C, LB T68C - Hyper Mini TOPLED® LB M676 - Mini TOPLED Santana® LG M470 LS M47K, LO M47K, LY M47K Source: http://www.osram.convergy.de LUXEON: - LUMILED® LXK2-PW12-R00, LXK2-PW12-S00, LXK2-PW14-U00, LXK2-PW14-V00 LXK2-PM12-R00, LXK2-PM12-S00, LXK2-PM14-U00 LXK2-PE12-Q00, LXK2-PE12-R00, LXK2-PE12-S00, LXK2-PE14-T00, LXK2-PE14-U00 LXK2-PB12-K00, LXK2-PB12-L00, LXK2-PB12-M00, LXK2-PB14-N00, LXK2-PB14-P00, LXK2-PB14-Q00 LXK2-PR12-L00, LXK2-PR12-M00, LXK2-PR14-Q00, LXK2-PR14-R00 LXK2-PD12-Q00, LXK2-PD12-R00, LXK2-PD12-S00 LXK2-PH12-R00, LXK2-PH12-S00 LXK2-PL12-P00, LXK2-PL12-Q00, LXK2-PL12-R00 Source: www.luxeon.com KINGBRIGHT: KA-3528ASYC Source: www.kingbright.com
L1-L5 = wuerth-elektronik:WE-CBF: SMD EMI Suppression Ferrite Beads - excellent anti-EMI properties - low DCR - impedances till 3000 ohms - rated current up to 6 A
L6 = SmartPrj:L-US: INDUCTOR, American symbol
Q1 = zetex:PMOSSOT23: MOS FET
Q2 = transistor-npn:BC847*: NPN Transistor
Q3 = zetex:NMOSSOT23: MOS FET; OC_FARNELL: unknown; OC_NEWARK: unknown
Q4 = GAAextensions:*-NPN-: NPN Transistror
R1-R31 R44-R49 = rcl:R-US_: RESISTOR, American symbol
RESET = SmartPrj:TS42: TS42 Dongnan Electronics Tact switch VDC 12V - 50mA
RN1-RN4 = resistor-dil:4R-N: Array Chip Resistor Source: RS Component / Phycomp
SJ1 = jumper:SJ: SMD solder JUMPER
SW1 = SparkFun-Electromechanical:ENCODER_RGB_CA: Illuminated Rotary Encoder w/ RGB LED and select switch EC12PLRGBSDVBF-D: http://top-up.so-buy.com/front/bin/ptdetail.phtml?Part=EC12PLRGBSDVBF-D
U1 = Littelfuse_By_element14_Batch_1:SP723ABG: TVS Diode Arrays; MPN: SP723ABG; OC_FARNELL: 1827642; OC_NEWARK: 80K9824; PACKAGE: SOIC-8; SUPPLIER: LITTELFUSE
U3 = microbuilder:74HC4050D: 6-channel level shifter 74HC4050D - 2V-6V Supply Digikey: 74HC4050D,653-ND Mouser: 771-74HC4050D-T
USB1 = SmartPrj:MICRO_USB: Micro_USB ADAM-TECH MCR-AB1-S-RA-SMT
Y1 = SmartPrj:CRYSTAL-3.2-2.5
Y2 = CM8V-T1A-32.768KHZ-9PF-20PPM-TA-QC:CM8V-T1A-32.768KHZ-9PF-20PPM-TA-QC; DESCRIPTION: LOW FREQUENCY CRYSTAL; DIGI-KEY_PART_NUMBER: 2195-CM8V-T1A-32.768KHZ-9PF-20PPM-TA-QCCT-ND; MF: Micro Crystal AG; MP: CM8V-T1A-32.768KHZ-9PF-20PPM-TA-QC; PACKAGE: SMD-2 Micro Crystal
Z1-Z3 = varistor:VARISTOR: VARISTOR

## Net classes
0 default: width 0.203 mm, drill 0.254 mm, clearance 0.152 mm
1 USB: width 0.203 mm, drill 0.254 mm, clearance 0.152 mm
3 usbvcc: width 0.203 mm, drill 0.254 mm, clearance 0.152 mm
4 USBpair: width 0.254 mm, drill 0.254 mm, clearance 0.152 mm